# EAGLE schematic cyberdriver (EAGLE 6.5.0)
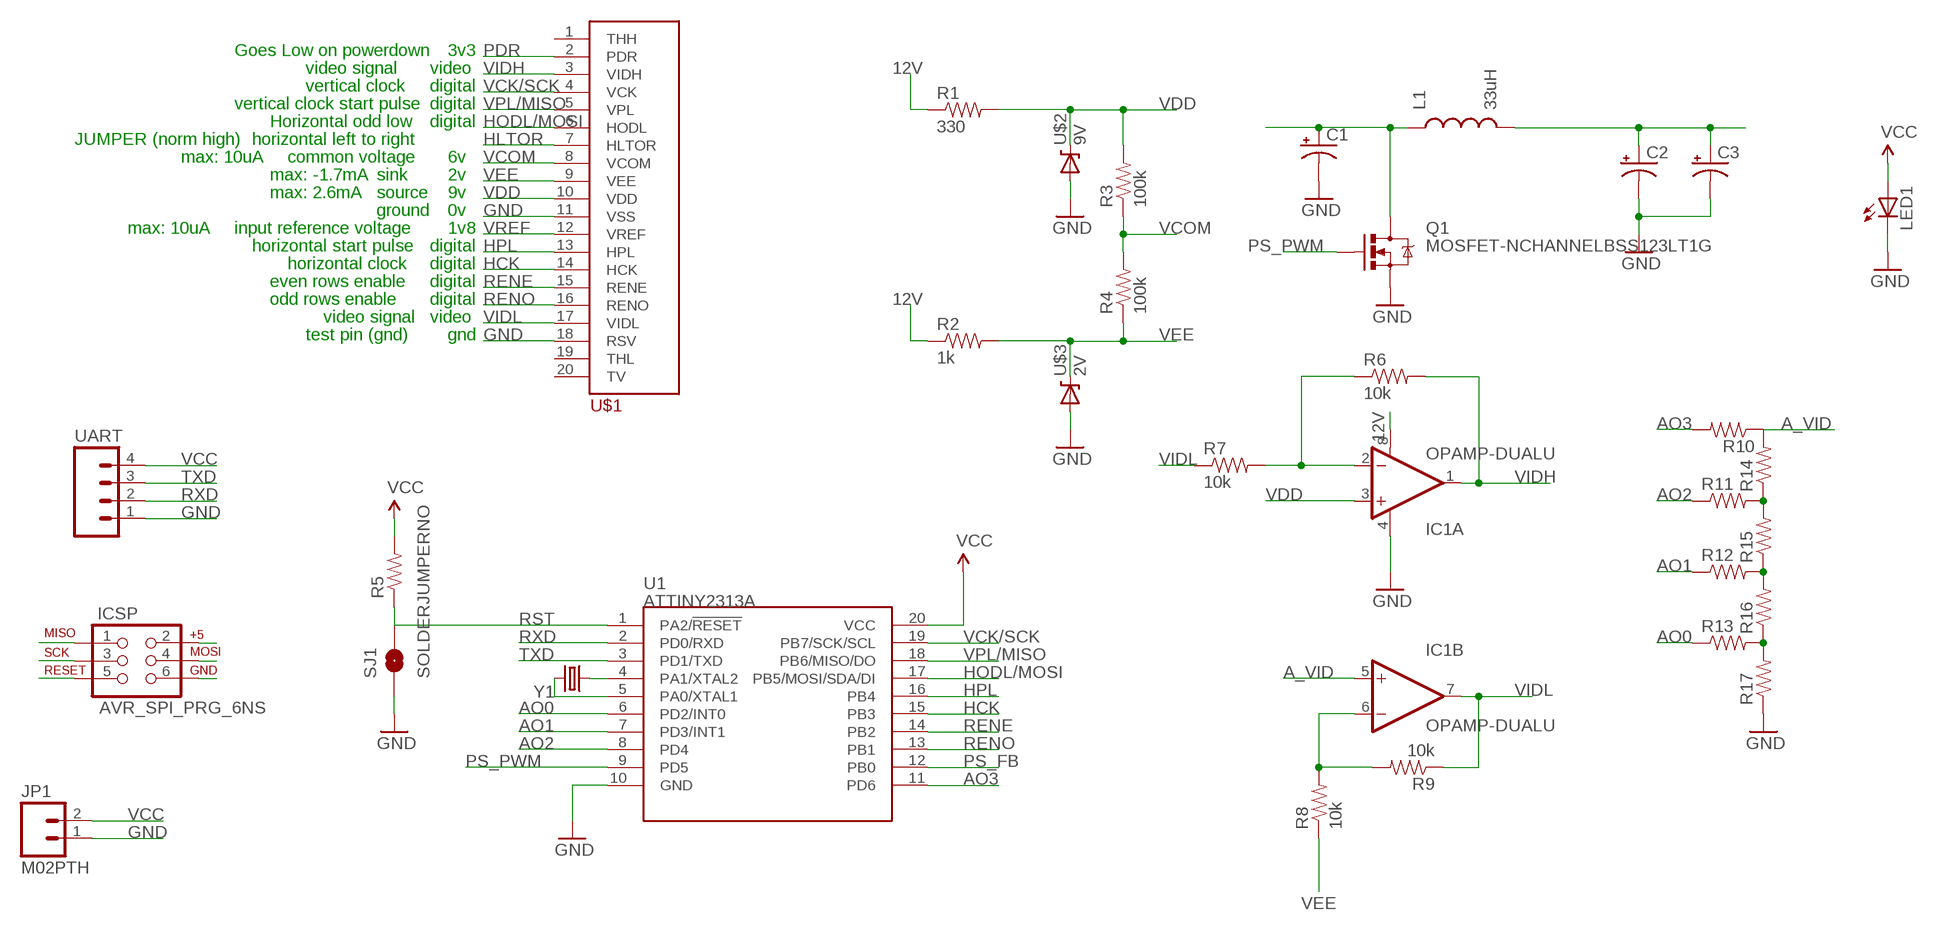
[diagram p0: schematic, sheet 1]

## Parts
C1  CAP_POLC  [PANASONIC_C]
C2  CAP_POLC  [PANASONIC_C]
C3  CAP_POL1206  [EIA3216]
IC1  OPAMP-DUALU  [SO08@1]
ICSP  AVR_SPI_PRG_6NS  [2X3-NS]
JP1  M02PTH  [1X02]
L1  33uH  INDUCTORBOURNS_SRN6045  [SRN6045]
LED1  LED1206  [LED-1206]
Q1  MOSFET-NCHANNELBSS123LT1G  [SOT23]
R1  330  RESISTOR0603-RES  [0603-RES]
R2  1k  RESISTOR0603-RES  [0603-RES]
R3  100k  RESISTOR0805-RES  [0805]
R4  100k  RESISTOR0805-RES  [0805]
R5  RESISTOR0805-RES  [0805]
R6  10k  RESISTOR0805-RES  [0805]
R7  10k  RESISTOR0805-RES  [0805]
R8  10k  RESISTOR0805-RES  [0805]
R9  10k  RESISTOR0805-RES  [0805]
R10  RESISTOR0805-RES  [0805]
R11  RESISTOR0805-RES  [0805]
R12  RESISTOR0805-RES  [0805]
R13  RESISTOR0805-RES  [0805]
R14  RESISTOR0805-RES  [0805]
R15  RESISTOR0805-RES  [0805]
R16  RESISTOR0805-RES  [0805]
R17  RESISTOR0805-RES  [0805]
SJ1  SOLDERJUMPERNO  [SJ_2S-NO]
U1  ATTINY2313A  [SOP20W]
U$1  CYBERDISPLAY-CONN  [MOLEX-54550-2071]
U$2  9V  DIODE-ZENER-BZT52  [SOD-323]
U$3  2V  DIODE-ZENER-BZT52  [SOD-323]
UART  M04PTH  [1X04]
Y1  CRYSTAL5X3  [CRYSTAL-SMD-5X3]

## Nets
12V: C2.+ C3.A(+) IC1.8(A:V+) L1.2 R1.1 R2.1
A_VID: IC1.5(B:+IN) R10.1 R14.2
AO0: R13.1 U1.6(PD2/INT0)
AO1: R12.1 U1.7(PD3/INT1)
AO2: R11.1 U1.8(PD4)
AO3: R10.2 U1.11(PD6)
GND: C1.- C2.- C3.C(-) IC1.4(A:V-) ICSP.6 JP1.1 LED1.C Q1.2(S) R17.1 SJ1.1 U1.10(GND) U$1.11(VSS) U$1.18(RSV) U$2.A U$3.A UART.1
HCK: U1.15(PB3) U$1.14(HCK)
HLTOR: U$1.7(HLTOR)
HODL/MOSI: ICSP.4 U1.17(PB5/MOSI/SDA/DI) U$1.6(HODL)
HPL: U1.16(PB4) U$1.13(HPL)
N$1: U1.5(PA0/XTAL1) Y1.3
N$2: U1.4(PA1/XTAL2) Y1.1
N$3: C1.+ L1.1 Q1.3(D)
N$5: IC1.2(A:-IN) R6.1 R7.2
N$6: R11.2 R14.1 R15.2
N$7: IC1.6(B:-IN) R8.2 R9.2
N$9: R12.2 R15.1 R16.2
N$11: R13.2 R16.1 R17.2
PDR: U$1.2(PDR)
PS_FB: U1.12(PB0)
PS_PWM: Q1.1(G) U1.9(PD5)
RENE: U1.14(PB2) U$1.15(RENE)
RENO: U1.13(PB1) U$1.16(RENO)
RST: ICSP.5 R5.1 SJ1.2 U1.1(PA2/!RESET)
RXD: U1.2(PD0/RXD) UART.2
TXD: U1.3(PD1/TXD) UART.3
VCC: ICSP.2 JP1.2 LED1.A R5.2 U1.20(VCC) UART.4
VCK/SCK: ICSP.3 U1.19(PB7/SCK/SCL) U$1.4(VCK)
VCOM: R3.1 R4.2 U$1.8(VCOM)
VDD: IC1.3(A:+IN) R1.2 R3.2 U$1.10(VDD) U$2.C
VEE: R2.2 R4.1 R8.1 U$1.9(VEE) U$3.C
VIDH: IC1.1(A:OUT) R6.2 U$1.3(VIDH)
VIDL: IC1.7(B:OUT) R7.1 R9.1 U$1.17(VIDL)
VPL/MISO: ICSP.1 U1.18(PB6/MISO/DO) U$1.5(VPL)
VREF: U$1.12(VREF)
Unconnected: U$1.1(THH) U$1.19(THL) U$1.20(TV)

## Notes on the sheet
- Goes Low on powerdown | 3v3
- video signal | video
- vertical clock | digital
- vertical clock start pulse | digital
- Horizontal odd low | digital
- JUMPER (norm high) | horizontal left to right
- max: 10uA | common voltage | 6v
- max: -1.7mA | sink | 2v
- max: 2.6mA | source | 9v
- ground | 0v
- max: 10uA | input reference voltage | 1v8
- horizontal start pulse | digital
- horizontal clock | digital
- even rows enable | digital
- odd rows enable | digital
- video signal | video
- test pin (gnd) | gnd

## Library data of the parts
C1-C3 = cyberdriver:CAP_POL: Capacitor Polarized These are standard SMD and PTH capacitors. Normally 10uF, 47uF, and 100uF in electrolytic and tantalum varieties. Always verify the external diameter of the through hole cap, it varies with capacity, voltage, and manufacturer. The EIA devices should be standard.
IC1 = cyberdriver:OPAMP-DUAL: Generic op-amp footprint
ICSP = cyberdriver:AVR_SPI_PRG_6: AVR ISP 6 Pin This is the reduced ISP connector for AVR programming. Common on Arduino. This footprint will take up less PCB space and can be used with a 10-pin to 6-pin adapter such as SKU: BOB-08508
JP1 = cyberdriver:M02: Standard 2-pin 0.1" header. Use with - straight break away headers ( PRT-00116) - right angle break away headers (PRT-00553) - swiss pins (PRT-00743) - machine pins (PRT-00117) - female headers (PRT-00115) Molex polarized connector foot print use with: PRT-08233 with associated crimp pins and housings. 2.54_SCREWTERM for use with PRT-10571. 3.5mm Screw Terminal footprints for PRT-08084 5mm Screw Terminal footprints for use with PRT-08433
L1 = cyberdriver:INDUCTOR: Inductors Basic Inductor/Choke - 0603 and 1206. Footprints are not proven and vary greatly between part numbers. SRN6045- 33uH, 20% 1.4A SDR0403-560KL - 56uH, 10%, 500mA RMS/740mA peak; PROD_ID: NDUC-11627
LED1 = cyberdriver:LED: LEDs Standard schematic elements and footprints for 5mm, 3mm, 1206, and 0603 sized LEDs. 5mm - Spark Fun Electronics SKU : COM-00529 (and others)
Q1 = cyberdriver:MOSFET-NCHANNEL: Common NMOSFET Parts MFG P/N Store ID Prod ID FDD8780 TRANS-09984 SI7820DN TRANS-11055 FDS6630A IC-08089 2N7002PW TRANS-11151 FQP30N06L COM-10213 TRANS-10060 BSS123LT1G TRANS-08345 BSS138 TRANS-00830 BS170 2N7000; PROD_ID: TRANS-08345
R1-R17 = cyberdriver:RESISTOR: Resistor Basic schematic elements and footprints for 0603, 1206, and PTH resistors.
SJ1 = cyberdriver:SOLDERJUMPER: Solder Jumper Standard SMD solder jumper. Used to automate production. Two varients : Normally Open and Normally Closed are the same, but have different paste layers. NC will have a large amount of paste and should jumper during reflow.
U1 = cyberdriver:ATTINY2313A: ATTINY2313A 2kB 20MHz I2C/SPI/UART; PROD_ID: IC-11305
U$1 = cyberdriver:CYBERDISPLAY-CONN
U$2 U$3 = cyberdriver:DIODE-ZENER: Zener Diode Production Part - 8199 3.4V Zener Voltage
UART = cyberdriver:M04: Header 4 Standard 4-pin 0.1" header. Use with straight break away headers (SKU : PRT-00116), right angle break away headers (PRT-00553), swiss pins (PRT-00743), machine pins (PRT-00117), and female headers (PRT-00115). Molex polarized connector foot print use with SKU : PRT-08231 with associated crimp pins and housings. 1MM SMD Version SKU: PRT-10208
Y1 = cyberdriver:CRYSTAL: Various standard crystals. Proven footprints. Spark Fun Electronics SKU : COM-00534